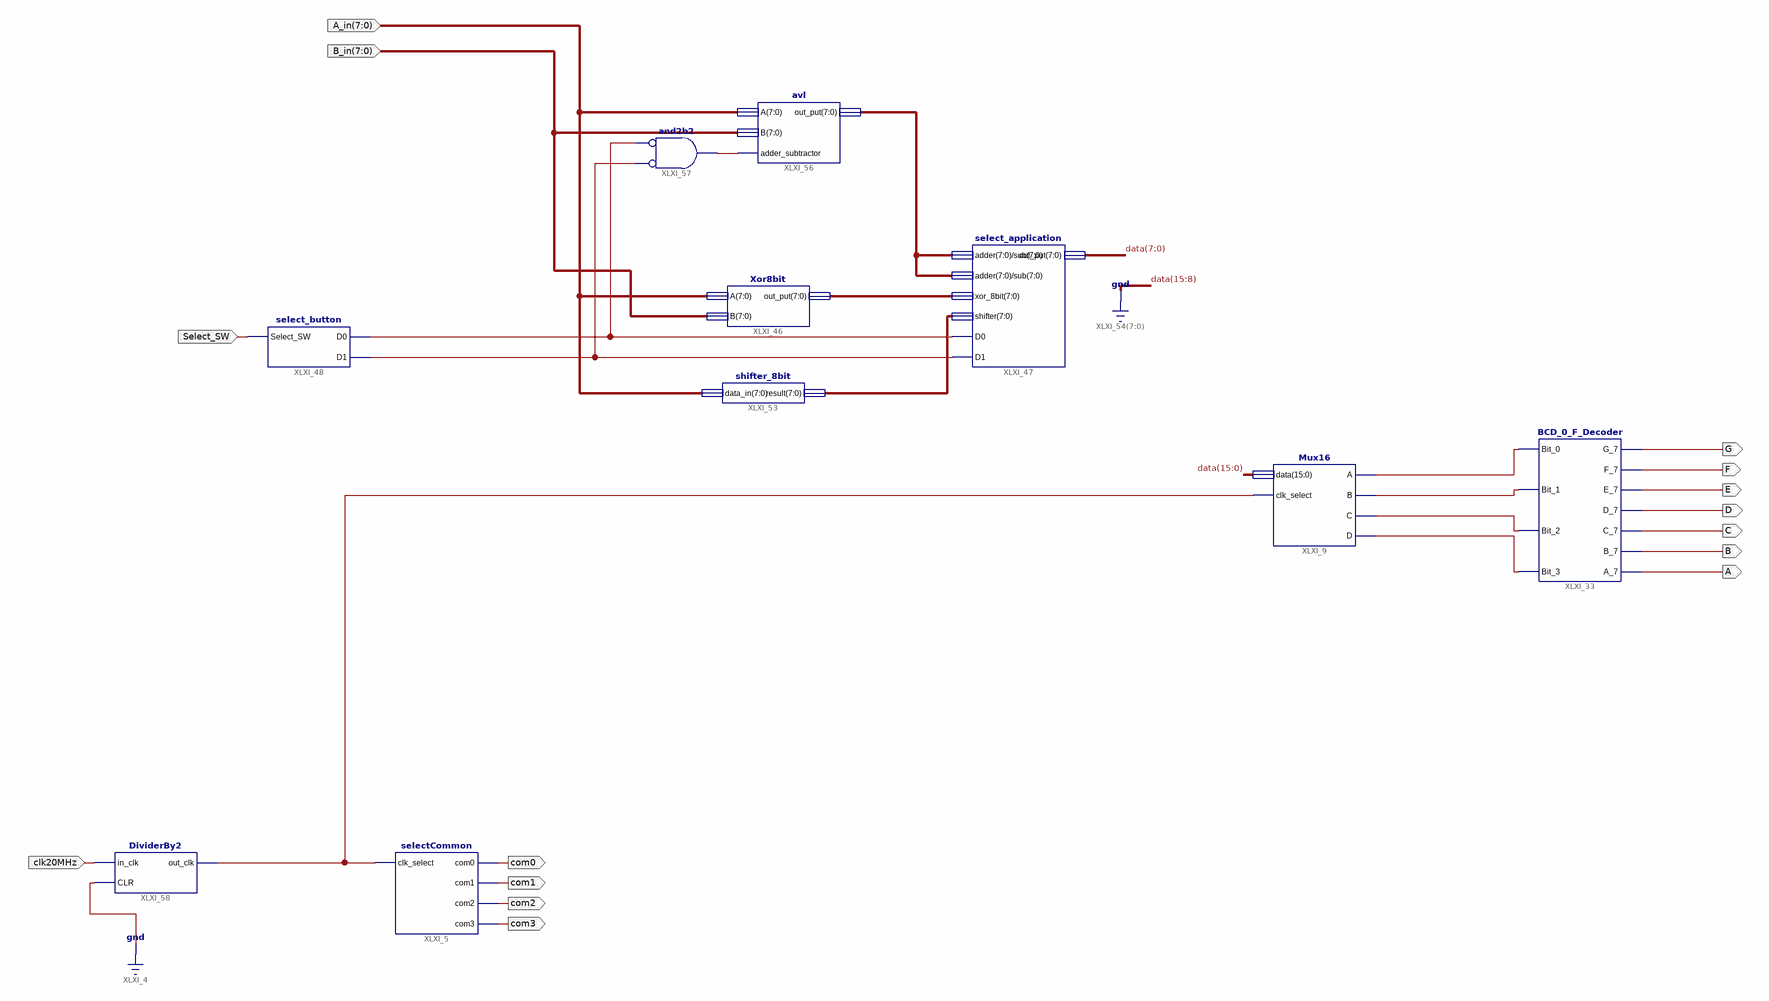
[diagram p0: schematic sheet 1]
// Xilinx ISE schematic ALU.sch (spartan6) as structural Verilog: 10 symbols, 15 ports
module ALU (
  input  [7:0] A_in,
  input  [7:0] B_in,
  input  Select_SW,
  input  clk20MHz,
  output G,
  output F,
  output E,
  output D,
  output C,
  output B,
  output A,
  output com3,
  output com2,
  output com1,
  output com0
);

  wire CLK_2MHZ, XLXN_100, XLXN_101, XLXN_102, XLXN_103, XLXN_144, XLXN_148, XLXN_149;
  wire [7:0] data, XLXN_120, XLXN_121, XLXN_150;

  BCD_0_F_Decoder XLXI_33 (
    .Bit_0(XLXN_100), .Bit_1(XLXN_101), .Bit_2(XLXN_102), .Bit_3(XLXN_103), .G_7(G), .F_7(F), .E_7(E),
    .D_7(D), .C_7(C), .A_7(A), .B_7(B));
  selectCommon XLXI_5 (.clk_select(CLK_2MHZ), .com0(com0), .com1(com1), .com2(com2), .com3(com3));
  Mux16 XLXI_9 (
    .A(XLXN_100), .B(XLXN_101), .C(XLXN_102), .clk_select(CLK_2MHZ), .D(XLXN_103), .data({{8{1'b0}}, data}));
  Xor8bit XLXI_46 (.A(A_in), .B(B_in), .out_put(XLXN_121));
  select_application XLXI_47 (
    .adder(XLXN_120), .D0(XLXN_149), .D1(XLXN_148), .out_put(data), .shifter(XLXN_150), .sub(XLXN_120),
    .xor_8bit(XLXN_121));
  select_button XLXI_48 (.Select_SW(Select_SW), .D0(XLXN_149), .D1(XLXN_148));
  shifter_8bit XLXI_53 (.data_in(A_in), .result(XLXN_150));
  avl XLXI_56 (.A(A_in), .adder_subtractor(XLXN_144), .B(B_in), .out_put(XLXN_120));
  and XLXI_57 (XLXN_144, ~XLXN_148, ~XLXN_149);  // and2b2
  DividerBy2 XLXI_58 (.CLR(1'b0), .in_clk(clk20MHz), .out_clk(CLK_2MHZ));

  // Notes on the sheet:
  //   CLOCK_DEDICATED_ROUTE on signal Select_SW = False
endmodule
